# EAGLE design regulator (EAGLE 5.06)
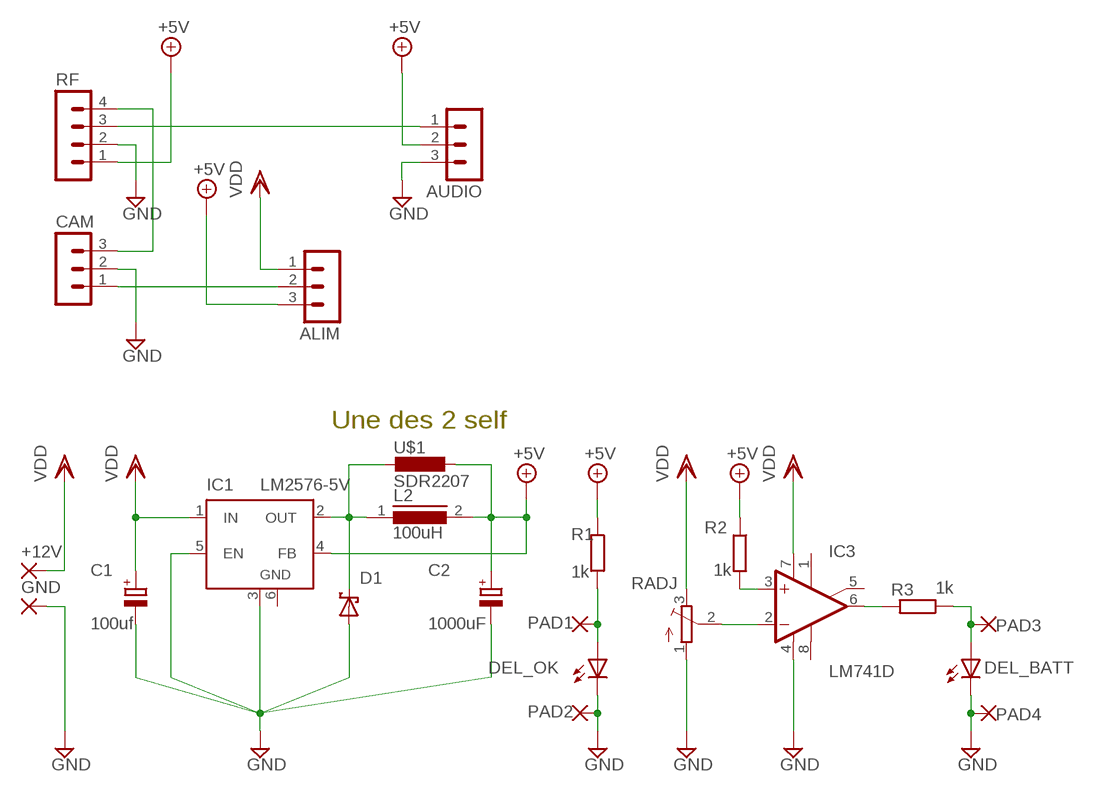
[diagram p0: schematic, sheet 1]

## Parts
+12V  3,81/1,4  [3,81/1,4]
ALIM  MA03-1  [MA03-1]
AUDIO  MA03-1  [MA03-1]
C1  100uf  CPOL-EUE  [PANASONIC_E]
C2  1000uF  CPOL-EUG  [PANASONIC_G]
CAM  MA03-1  [MA03-1]
D1  SCHOTTKY-DIODESMC  [SMC]
DEL_BATT  LEDCHIPLED_0805  [CHIPLED_0805]
DEL_OK  LEDCHIPLED_0805  [CHIPLED_0805]
GND  3,81/1,4  [3,81/1,4]
IC1  LM2576-5V  LM2596S  [TO263-5]
IC3  LM741D  [SO08]
L2  100uH  ED16  [ED16]
PAD1  SMD2  [SMD1,27-2,54]
PAD2  SMD2  [SMD1,27-2,54]
PAD3  SMD2  [SMD1,27-2,54]
PAD4  SMD2  [SMD1,27-2,54]
R1  1k  R-EU_M0805  [M0805]
R2  1k  R-EU_M0805  [M0805]
R3  1k  R-EU_M0805  [M0805]
RADJ  TRIM_EU-SM-42/43W  [SM-42/43W]
RF  MA04-1  [MA04-1]
U$1  SDR2207  [SM]

## Nets
+5V: ALIM.3 AUDIO.2 C2.+ IC1.4(FB) L2.2 R1.1 R2.1 RF.1 U$1.P$2
GND: AUDIO.3 C1.- C2.- CAM.2 D1.A DEL_BATT.C DEL_OK.C GND.1(P) IC1.3(GND) IC1.5(EN) IC3.4(V-) PAD2.1(P) PAD4.1(P) RADJ.1(A) RF.2
N$1: DEL_OK.A PAD1.1(P) R1.2
N$2: D1.C IC1.2(OUT) L2.1 U$1.P$1
N$3: ALIM.2 CAM.1
N$6: AUDIO.1 RF.3
N$10: CAM.3 RF.4
N$15: IC3.2(-IN) RADJ.2(S)
N$16: IC3.6(OUT) R3.2
N$18: IC3.3(+IN) R2.2
N$27: DEL_BATT.A PAD3.1(P) R3.1
VDD: +12V.1(P) ALIM.1 C1.+ IC1.1(IN) IC3.7(V+) RADJ.3(E)
Unconnected: IC3.1(ON1) IC3.5(ON2) IC3.8(OPT)

## Notes on the sheet
- Une des 2 self

## Power pins joined to a net without a drawn wire
GND: IC1.6(GND)

## Library data of the parts
+12V GND = wirepad:3,81/1,4: THROUGH-HOLE PAD
ALIM AUDIO CAM = con-lstb:MA03-1: PIN HEADER
C1 C2 = rcl:CPOL-EU: POLARIZED CAPACITOR, European symbol
D1 = diode:SCHOTTKY-DIODE: Schottky Diode
DEL_BATT DEL_OK = led:LED: LED OSRAM: - CHIPLED LG R971, LG N971, LY N971, LG Q971, LY Q971, LO R971, LY R971 LH N974, LH R974 LS Q976, LO Q976, LY Q976 LO Q996 - Hyper CHIPLED LW Q18S LB Q993, LB Q99A, LB R99A - SideLED LS A670, LO A670, LY A670, LG A670, LP A670 LB A673, LV A673, LT A673, LW A673 LH A674 LY A675 LS A676, LA A676, LO A676, LY A676, LW A676 LS A679, LY A679, LG A679 - Hyper Micro SIDELED® LS Y876, LA Y876, LO Y876, LY Y876 LT Y87S - SmartLED LW L88C, LW L88S LB L89C, LB L89S, LG L890 LS L89K, LO L89K, LY L89K LS L896, LA L896, LO L896, LY L896 - TOPLED LS T670, LO T670, LY T670, LG T670, LP T670 LSG T670, LSP T670, LSY T670, LOP T670, LYG T670 LG T671, LOG T671, LSG T671 LB T673, LV T673, LT T673, LW T673 LH T674 LS T676, LA T676, LO T676, LY T676, LB T676, LH T676, LSB T676, LW T676 LB T67C, LV T67C, LT T67C, LS T67K, LO T67K, LY T67K, LW E67C LS E67B, LA E67B, LO E67B, LY E67B, LB E67C, LV E67C, LT E67C LW T67C LS T679, LY T679, LG T679 LS T770, LO T770, LY T770, LG T770, LP T770 LB T773, LV T773, LT T773, LW T773 LH T774 LS E675, LA E675, LY E675, LS T675 LS T776, LA T776, LO T776, LY T776, LB T776 LHGB T686 LT T68C, LB T68C - Hyper Mini TOPLED® LB M676 - Mini TOPLED Santana® LG M470 LS M47K, LO M47K, LY M47K Source: http://www.osram.convergy.de LUXEON: - LUMILED® LXK2-PW12-R00, LXK2-PW12-S00, LXK2-PW14-U00, LXK2-PW14-V00 LXK2-PM12-R00, LXK2-PM12-S00, LXK2-PM14-U00 LXK2-PE12-Q00, LXK2-PE12-R00, LXK2-PE12-S00, LXK2-PE14-T00, LXK2-PE14-U00 LXK2-PB12-K00, LXK2-PB12-L00, LXK2-PB12-M00, LXK2-PB14-N00, LXK2-PB14-P00, LXK2-PB14-Q00 LXK2-PR12-L00, LXK2-PR12-M00, LXK2-PR14-Q00, LXK2-PR14-R00 LXK2-PD12-Q00, LXK2-PD12-R00, LXK2-PD12-S00 LXK2-PH12-R00, LXK2-PH12-S00 LXK2-PL12-P00, LXK2-PL12-Q00, LXK2-PL12-R00 Source: www.luxeon.com KINGBRIGHT: KA-3528ASYC Source: www.kingbright.com
IC1 = linear:LM2596S: STEP-DOWN VOLTAGE REGULATOR
IC3 = linear:*741: OP AMP
L2 = inductors:ED16: INDUCTOR
PAD1-PAD4 = wirepad:SMD2: SMD PAD
R1-R3 = rcl:R-EU_: RESISTOR, European symbol
RADJ = pot:TRIM_EU-: POTENTIOMETER
RF = con-lstb:MA04-1: PIN HEADER
U$1 = bourns-inductor:SDR2207

## Board
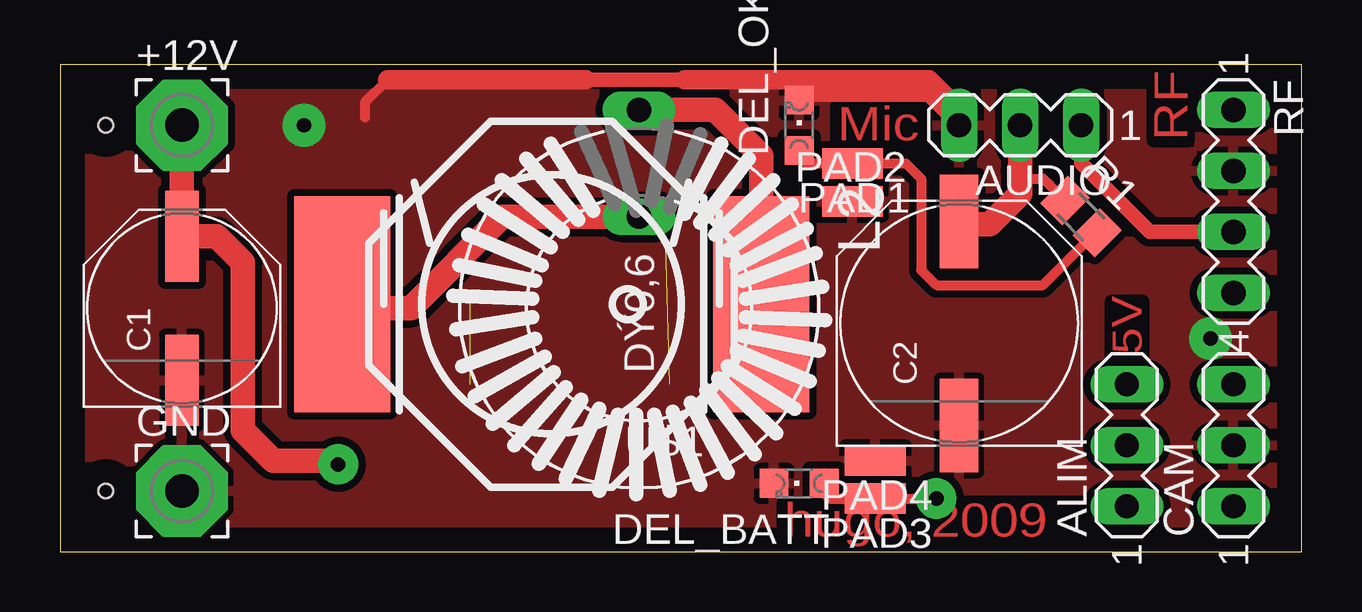
[diagram p1: board, top side]
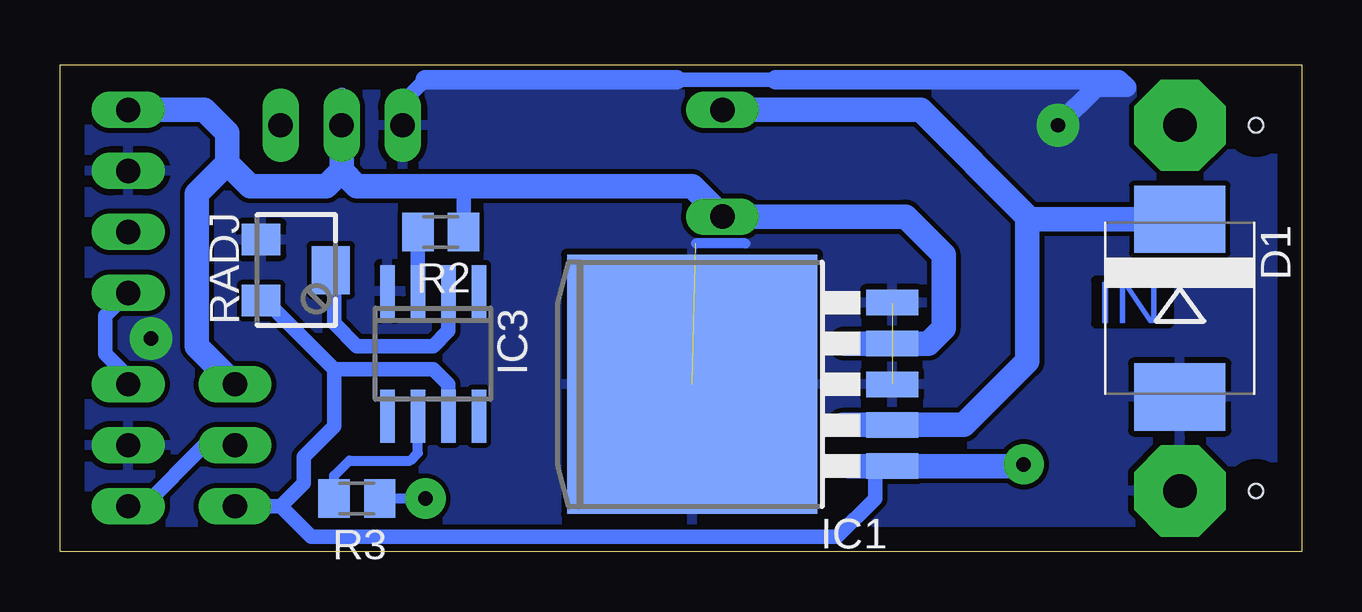
[diagram p2: board, bottom side, seen from below]

Size 51.74 x 20.31 mm. Coordinates in mm from the lower left corner, seen from the top.
Outline: 0,0 51.74,0 51.74,20.31 0,20.31 0,0
Copper layers (1*16): Top 0.035mm / dielectric 1.5mm / Bottom 0.035mm
Design rules "default": minimum track width 10mil, minimum drill 24mil, track to track 8mil, track to pad 8mil, pad to pad 8mil, via to via 8mil, smd to smd 8mil, copper to edge 40mil, drill to drill 8mil, minimum pad ring 10mil, minimum via ring 8mil, stop-mask expansion 4mil, vias tented up to drill 0mil, thermal gap 10mil
Holes 0.6 mm at 1.91,17.78 1.91,2.54

### Footprints (pad centres in the part's own frame; a part is rotated, then mirrored left to right if it is on the bottom)
3,81/1,4 = drill 1.397 pad 3.81 octagon: 1 0,0
MA03-1 = drill 1.016 long: 1 -2.54,0; 2 0,0; 3 2.54,0
PANASONIC_E = smd 3.8 x 1.4: + 3,0; - -3,0
PANASONIC_G = smd 3.9 x 1.6: + 4.25,0; - -4.25,0
SMC = smd 2.8 x 3.8: A 3.7,0; C -3.7,0
CHIPLED_0805 = smd 1.2 x 1.2: A 0,-1.05; C 0,1.05
TO263-5 = smd 1.067 x 2.159: 1 -3.404,-5.791; 2 -1.702,-5.791; 3 0,-5.791; 4 1.702,-5.791; 5 3.404,-5.791 | smd 10.8 x 10.41: 6 0,2.54
SO08 = smd 0.6 x 2.2: 1 -1.905,-2.6; 2 -0.635,-2.6; 3 0.635,-2.6; 4 1.905,-2.6; 5 1.905,2.6; 6 0.635,2.6; 7 -0.635,2.6; 8 -1.905,2.6
ED16 = drill 1.016 long: 1 -8.255,0; 2 -3.81,0
SMD1,27-2,54 = smd 1.27 x 2.54: 1 0,0
M0805 = smd 1.3 x 1.6: 1 -0.95,0; 2 0.95,0
SM-42/43W = smd 1.3 x 1.6: 1 -1.27,-1.45; 3 1.27,-1.45 | smd 2 x 1.6: 2 0,1.45
MA04-1 = drill 1.016 long: 1 -3.81,0; 2 -1.27,0; 3 1.27,0; 4 3.81,0
SM = smd 4 x 9: P$1 -8.74,0; P$2 8.72,0

### Placement (x,y rotation side)
+12V  5.08,17.78 0 top
ALIM  44.45,4.45 90 top
AUDIO  40.01,17.78 180 top
C1  5.08,10.16 90 top
C2  37.47,9.53 90 top
CAM  48.9,4.45 90 top
D1  5.08,10.16 270 bottom
DEL_BATT  30.8,2.86 90 top
DEL_OK  30.8,17.78 0 top
GND  5.08,2.54 0 top
IC1  22.86,6.99 90 bottom
IC3  36.2,8.26 180 bottom
L2  24.13,10.16 270 top
PAD1  33.02,16.19 90 top
PAD2  33.02,14.61 270 top
PAD3  33.97,2.22 90 top
PAD4  33.97,3.81 90 top
R1  42.55,13.97 315 top
R2  35.88,13.34 180 bottom
R3  39.37,2.22 180 bottom
RADJ  41.91,11.75 270 bottom
RF  48.9,14.61 270 top
U$1  20.48,10.32 180 top

### Tracks (layer width: path | path; a pad name or v marks a point on that pad's centre or on a via)
+5V
  Top 0.406: R1.1 41.27,15.24 40.96,15.56 40.01,15.56 40.01,15.88
  Top 1.016: C2.+ 37.47,13.65 38.73,13.65 40.01,14.92 40.01,15.88 AUDIO.2 | U$1.P$2 11.92,10.16 14.61,10.16 18.41,13.97 L2.2
  Bottom 0.254: 19.05,8.68 IC1.4
  Bottom 0.61: AUDIO.2 40.01,19.05 | R2.1 34.93,15.24 35.56,15.24
  Bottom 1.016: 40.01,15.88 AUDIO.2 | 40.01,15.88 39.37,15.24 35.56,15.24 25.4,15.24 L2.2 16.51,13.97 14.92,12.38 14.92,9.31 15.56,8.68 19.05,8.68 | 40.01,15.88 40.64,15.24 43.81,15.24 44.77,16.19 | ALIM.3 46.04,8.57 46.04,14.92 44.77,16.19 | 44.77,16.19 44.77,17.46 45.72,18.41 RF.1
GND  (via drill 0.6 pad 1.78)  (2 unrouted)
  Top 0.406: 12.7,18.1 12.7,18.73 13.65,19.68
  Top 0.61: 30.8,19.05 36.2,19.05 AUDIO.3 | 21.91,19.68 26.04,19.68
  Top 0.813: 13.65,19.68 21.91,19.68 | 26.04,19.68 36.2,19.68 37.47,18.41 AUDIO.3
  Bottom 0.406: 23.18,12.86 25.24,12.86
  Bottom 0.61: 36.51,19.68 37.47,18.73 | 21.91,19.68 26.04,19.68
  Bottom 0.813: 26.04,19.68 36.51,19.68 | 21.91,19.68 7.62,19.68 7.3,19.37 8.57,19.37 v10.16,17.78
  other vias: 47.94,8.89
  pour Bottom: 0,0 0,20.32 52.07,20.32 52.07,0
  pour Top (isolate 0.305): 0,0 0,20.32 52.07,20.32 52.07,0
N$1
  Top 0.406: DEL_OK.A 30.8,16.51 31.11,16.19 PAD1.1 35.24,16.19 35.88,15.56 35.88,11.75 36.51,11.11 40.96,11.11 43.14,13.3 R1.2
N$2
  Top 1.016: L2.1 27.3,18.41 29.22,16.5 U$1.P$1
  Bottom 0.254: 19.13,5.29 IC1.2
  Bottom 1.016: L2.1 15.88,18.41 11.43,13.97 | 19.13,5.29 14.07,5.29 11.43,7.94 11.43,13.97 | D1.C 11.32,13.86 11.43,13.97
N$3
  Bottom 0.61: ALIM.2 45.72,4.45 48.26,1.91 CAM.1
N$6
  Top 0.61: AUDIO.1 42.55,16.19 45.4,13.34 RF.3
N$10
  Bottom 0.61: CAM.3 48.9,7.3 49.85,8.26 49.85,9.84 RF.4
N$15
  Bottom 0.61: IC3.2 35.56,9.21 36.2,8.57 39.37,8.57 40.32,9.53 40.32,11.61 RADJ.2
N$16
  Bottom 0.406: R3.2 40.32,3.18 39.69,3.81 37.15,3.81 36.83,4.13 IC3.6
N$18
  Bottom 0.61: IC3.3 R2.2
N$27  (via drill 0.6 pad 1.68)
  Top 0.406: v36.51,2.22 PAD3.1 32.07,2.22 31.85,2.44 DEL_BATT.A
  Bottom 0.406: v36.51,2.22 R3.1
VDD  (via drill 0.6 pad 1.68)
  Top 1.016: +12V.1 C1.+ 6.53,13.16 7.62,12.06 7.62,5.08 8.89,3.81 11.43,3.81 v11.59,3.65
  Bottom 0.254: IC1.1 19.05,3.81
  Bottom 0.61: 42.55,1.91 ALIM.1 | 42.55,1.91 41.27,0.64 19.37,0.64 17.78,2.22 17.78,3.49 18.89,3.57 | IC3.7 35.56,6.99 36.2,7.62 40.32,7.62 | 42.55,1.91 41.59,2.86 41.59,3.97 40.32,5.24 40.32,7.62 | 40.32,7.62 43.18,10.48 RADJ.3
  Bottom 1.016: v11.59,3.65 11.67,3.57 18.89,3.57 IC1.1

### Text on the board
Top: Mic | RF | 5V | hugo, 2009
Bottom: IN